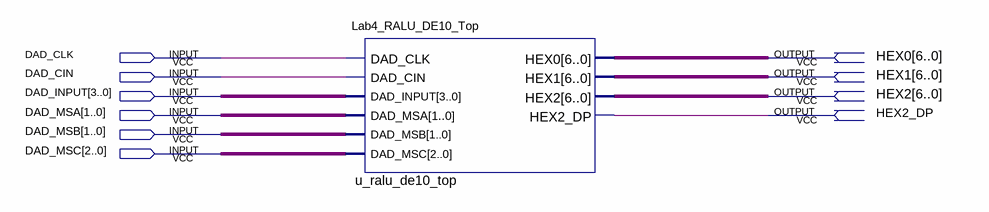
[diagram p0: schematic sheet]
// Quartus schematic Lab4_RALU.bdf as structural Verilog: 1 symbols, 10 pins
module Lab4_RALU (
  input  DAD_CLK,
  input  DAD_CIN,
  input  [3:0] DAD_INPUT,
  input  [1:0] DAD_MSA,
  input  [1:0] DAD_MSB,
  input  [2:0] DAD_MSC,
  output [6:0] HEX0,
  output [6:0] HEX1,
  output [6:0] HEX2,
  output HEX2_DP
);

  Lab4_RALU_DE10_Top u_ralu_de10_top (
    .DAD_CLK(DAD_CLK), .DAD_CIN(DAD_CIN), .DAD_INPUT(DAD_INPUT), .DAD_MSA(DAD_MSA), .DAD_MSB(DAD_MSB),
    .DAD_MSC(DAD_MSC), .HEX0(HEX0), .HEX1(HEX1), .HEX2(HEX2), .HEX2_DP(HEX2_DP));
endmodule
